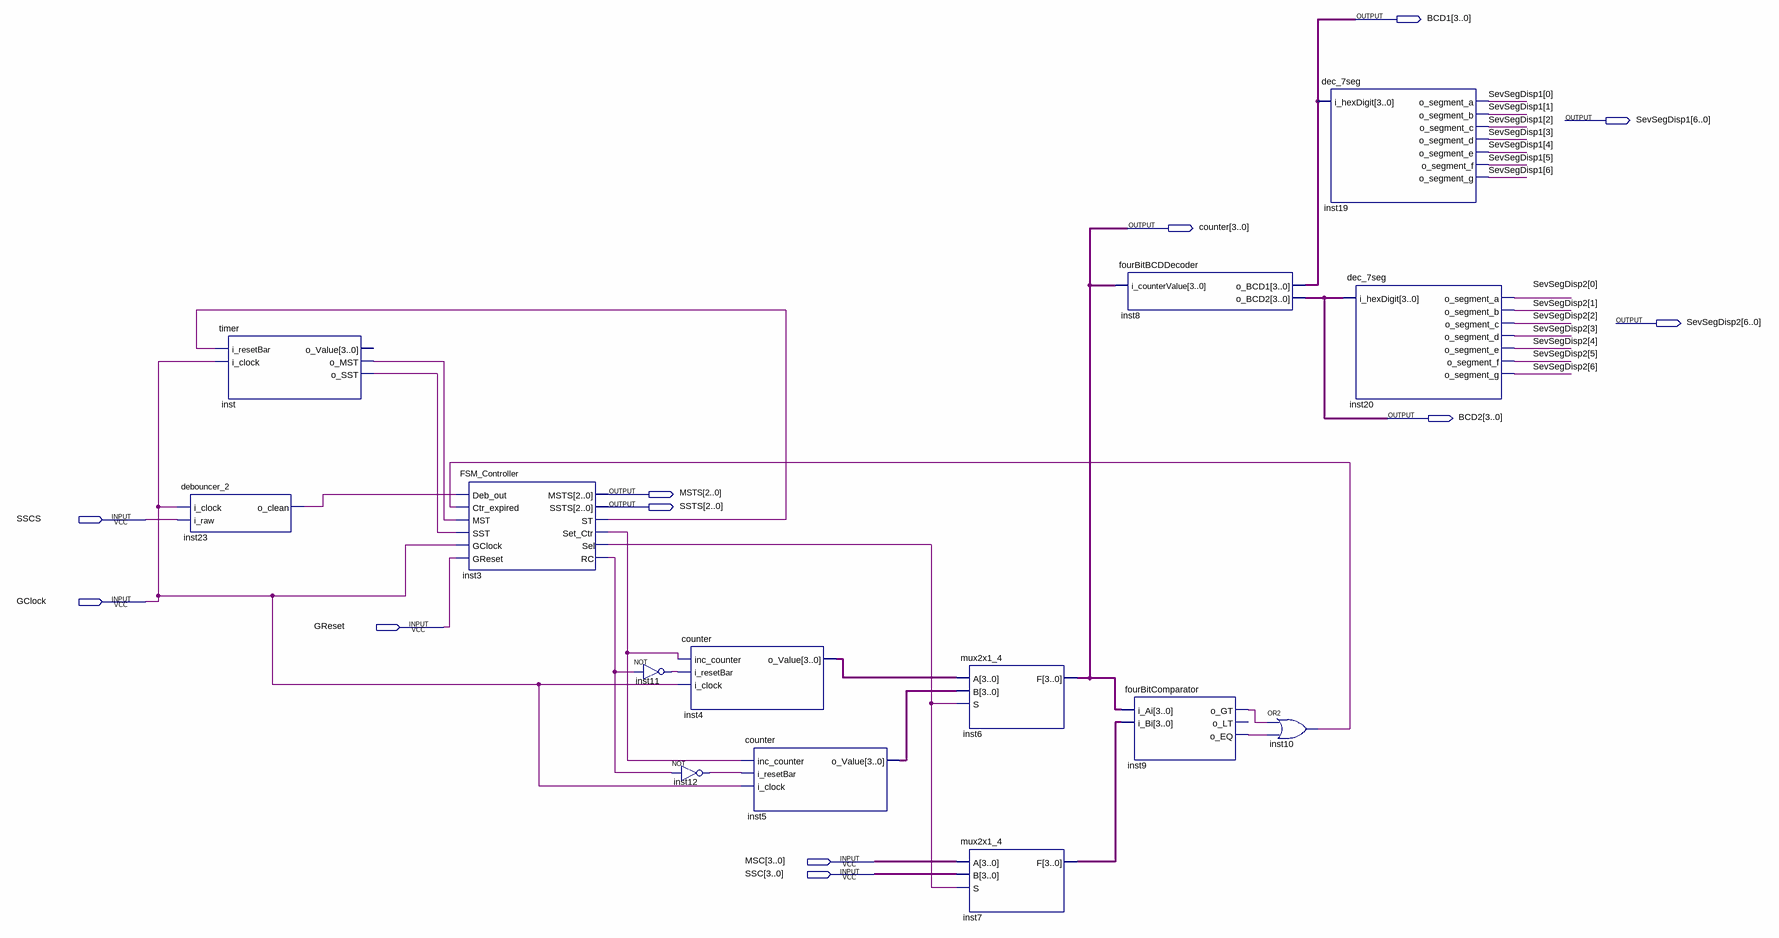
[diagram p0: schematic sheet]
// Quartus schematic lab3.bdf as structural Verilog: 14 symbols, 12 pins
module lab3 (
  input  SSCS,
  input  GClock,
  input  GReset,
  input  [3:0] MSC,
  input  [3:0] SSC,
  output [3:0] BCD1,
  output [6:0] SevSegDisp1,
  output [3:0] counter,
  output [6:0] SevSegDisp2,
  output [3:0] BCD2,
  output [2:0] MSTS,
  output [2:0] SSTS
);

  wire inst3_rc, inst3_sel, inst3_set_ctr, inst3_st, inst9_o_eq, inst9_o_gt, inst10_out, inst11_out,
       inst12_out, inst23_o_clean, inst_o_mst, inst_o_sst;
  wire [3:0] inst4_o_value, inst5_o_value, inst7_f;

  timer inst (.i_resetBar(inst3_st), .i_clock(GClock), .o_MST(inst_o_mst), .o_SST(inst_o_sst));  // open: o_Value
  debouncer_2 inst23 (.i_clock(GClock), .i_raw(SSCS), .o_clean(inst23_o_clean));
  FSM_Controller inst3 (
    .Deb_out(inst23_o_clean), .Ctr_expired(inst10_out), .MST(inst_o_mst), .SST(inst_o_sst), .GClock(GClock),
    .GReset(GReset), .MSTS(MSTS), .SSTS(SSTS), .ST(inst3_st), .Set_Ctr(inst3_set_ctr), .Sel(inst3_sel),
    .RC(inst3_rc));
  counter inst4 (.inc_counter(inst3_set_ctr), .i_resetBar(inst11_out), .i_clock(GClock), .o_Value(inst4_o_value));
  not inst11 (inst11_out, inst3_rc);
  not inst12 (inst12_out, inst3_rc);
  counter inst5 (.inc_counter(inst3_set_ctr), .i_resetBar(inst12_out), .i_clock(GClock), .o_Value(inst5_o_value));
  mux2x1_4 inst6 (.A(inst4_o_value), .B(inst5_o_value), .S(inst3_sel), .F(counter));
  mux2x1_4 inst7 (.A(MSC), .B(SSC), .S(inst3_sel), .F(inst7_f));
  fourBitBCDDecoder inst8 (.i_counterValue(counter), .o_BCD1(BCD1), .o_BCD2(BCD2));
  fourBitComparator inst9 (.i_Ai(counter), .i_Bi(inst7_f), .o_GT(inst9_o_gt), .o_EQ(inst9_o_eq));  // open: o_LT
  or inst10 (inst10_out, inst9_o_gt, inst9_o_eq);
  dec_7seg inst19 (
    .i_hexDigit(BCD1), .o_segment_a(SevSegDisp1[0]), .o_segment_b(SevSegDisp1[1]),
    .o_segment_c(SevSegDisp1[2]), .o_segment_d(SevSegDisp1[3]), .o_segment_e(SevSegDisp1[4]),
    .o_segment_f(SevSegDisp1[5]), .o_segment_g(SevSegDisp1[6]));
  dec_7seg inst20 (
    .i_hexDigit(BCD2), .o_segment_a(SevSegDisp2[0]), .o_segment_b(SevSegDisp2[1]),
    .o_segment_c(SevSegDisp2[2]), .o_segment_d(SevSegDisp2[3]), .o_segment_e(SevSegDisp2[4]),
    .o_segment_f(SevSegDisp2[5]), .o_segment_g(SevSegDisp2[6]));
endmodule
